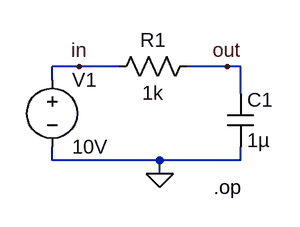
[diagram p0: schematic rc_example.asc]
rc_example.asc, the LTspice schematic file:
Version 4
SHEET 1 880 680
WIRE -144 96 -176 96
WIRE -96 96 -144 96
WIRE 32 96 -16 96
WIRE 48 96 32 96
WIRE -176 112 -176 96
WIRE 48 128 48 96
WIRE -176 208 -176 192
WIRE -48 208 -176 208
WIRE 48 208 48 192
WIRE 48 208 -48 208
WIRE -48 224 -48 208
FLAG -48 224 0
FLAG -144 96 in
FLAG 32 96 out
SYMBOL voltage -176 96 R0
WINDOW 123 0 0 Left 0
WINDOW 39 0 0 Left 0
SYMATTR InstName V1
SYMATTR Value 10V
SYMBOL res 0 80 R90
WINDOW 0 0 56 VBottom 2
WINDOW 3 32 56 VTop 2
SYMATTR InstName R1
SYMATTR Value 1k
SYMBOL cap 32 128 R0
SYMATTR InstName C1
SYMATTR Value 1µ
TEXT 16 240 Left 2 !.op

The netlist it stands for:
* rc_example.asc
V1 in 0 10V
R1 out in 1k
C1 out 0 1µ
.op
.backanno
.end